# Altium project SDR_PMR.PrjPcb (part 11 of 12)

## Sheet Power_3V3.SchDoc
size A4; SheetNumber: 4; SheetTotal: 18
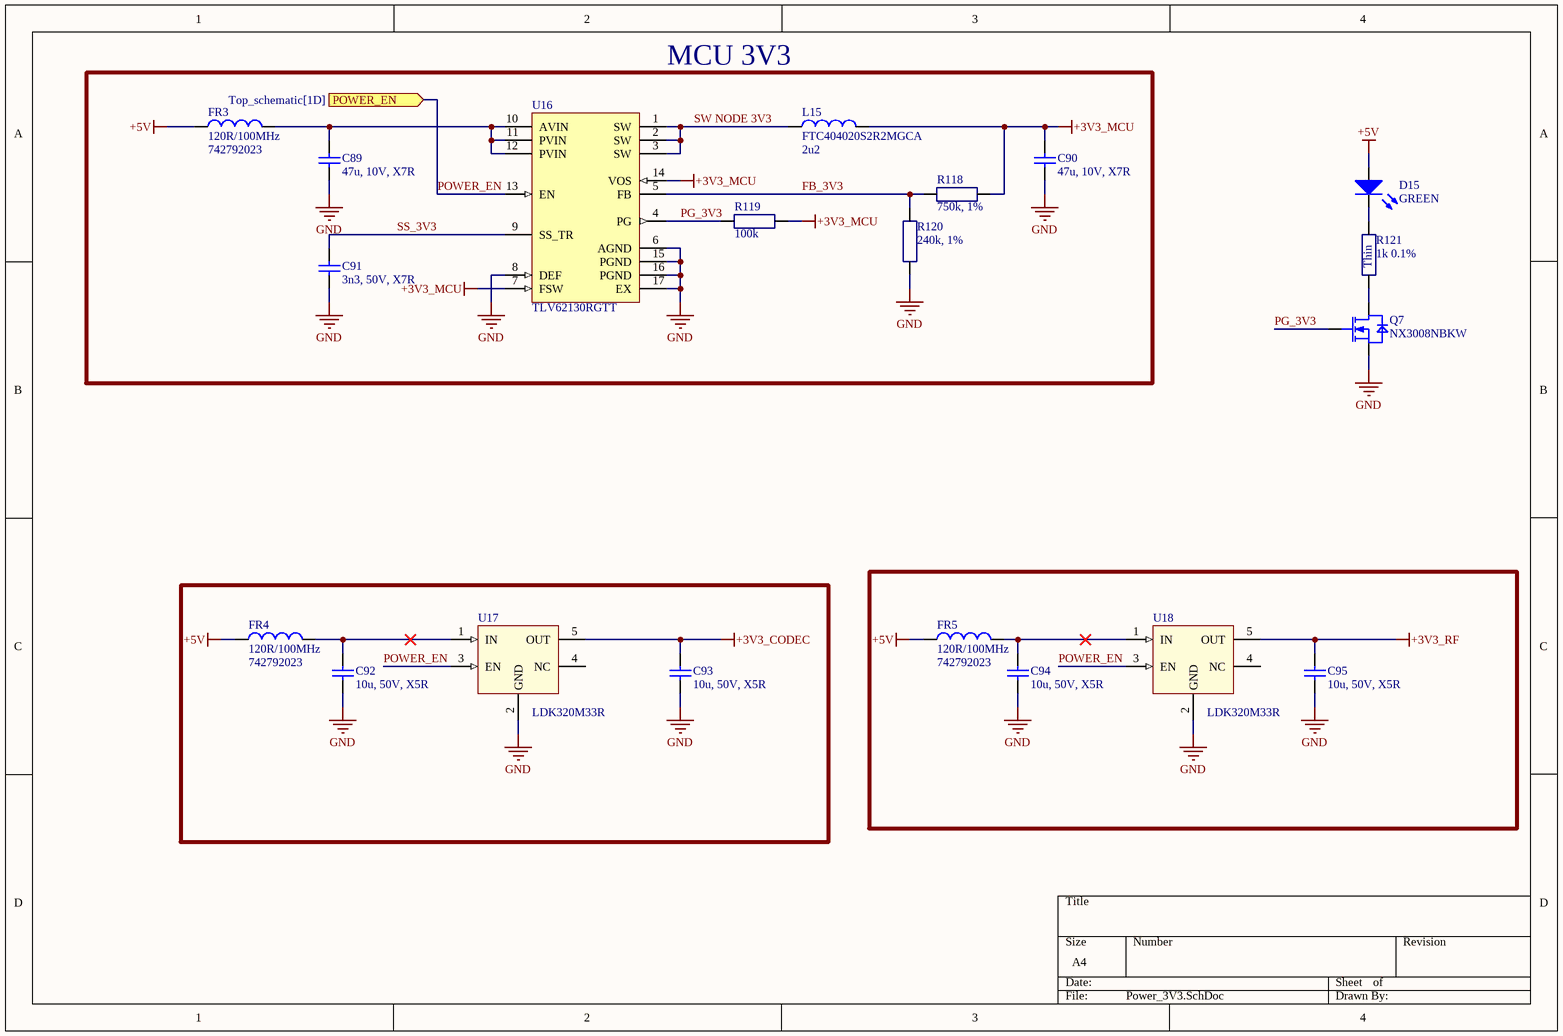
[diagram p15: Power_3V3.SchDoc]

### Parts
C89  47u, 10V, X7R  [SMD1210]
C90  47u, 10V, X7R  [SMD1210]
C91  3n3, 50V, X7R  [SMD0603]
C92  10u, 50V, X5R  [SMD1206]
C93  10u, 50V, X5R  [SMD1206]
C94  10u, 50V, X5R  [SMD1206]
C95  10u, 50V, X5R  [SMD1206]
D15  GREEN  [MCL-S270]
FR3  120R/100MHz  [SMD0805 - R]
FR4  120R/100MHz  [SMD0805 - R]
FR5  120R/100MHz  [SMD0805 - R]
L15  FTC404020S2R2MGCA  Inductance: 2u2  [FTC404020S]
Q7  NX3008NBKW  [SOT323]
R118  750k, 1%  [SMD0603 - R]
R119  100k  [SMD0402 - R]
R120  240k, 1%  [SMD0603 - R]
R121  1k 0.1%  [SMD0402 - R]
U16  TLV62130RGTT  [QFN50P300X300X80_HS-17M]
U17  LDK320M33R  [SOT23-5]
U18  LDK320M33R  [SOT23-5]

### Blocks framed on the sheet
MCU 3V3: C89-C91 FR3 L15 R118-R120 U16

### Ports
POWER_EN (in, see Top_schematic[1D])

### Nets
+3V3_CODEC: C93.2 U17.5(OUT)
+3V3_MCU: C90.2 L15.2 R118.2 R119.2 U16.7(FSW) U16.14(VOS)
+3V3_RF: C95.2 U18.5(OUT)
+5V: D15.1(A) FR3.1 FR4.1 FR5.1
GND: C89.1 C90.1 C91.1 C92.1 C93.1 C94.1 C95.1 Q7.2(S) R120.1 U16.6(AGND) U16.8(DEF) U16.15(PGND) U16.16(PGND) U16.17(EX) U17.2(GND) U18.2(GND)
FB_3V3: R118.1 R120.2 U16.5(FB)
PG_3V3: Q7.1(G) R119.1 U16.4(PG)
POWER_EN: U16.13(EN) U17.3(EN) U18.3(EN) ; port POWER_EN  [project net PG_5V]
SS_3V3: C91.2 U16.9(SS_TR)
SW NODE 3V3: L15.1 U16.1(SW) U16.2(SW) U16.3(SW)
NetC89_2: C89.2 FR3.2 U16.10(AVIN) U16.11(PVIN) U16.12(PVIN)
NetC92_2: C92.2 FR4.2 U17.1(IN)
NetC94_2: C94.2 FR5.2 U18.1(IN)
NetD15_2: D15.2(K) R121.2
NetQ7_3: Q7.3(D) R121.1

Not connected (* = marked no-connect by the designer): U17 4(NC); U18 4(NC)

### Notes on the sheet
- (in symbol TC0225B1001TCC) Thin

### Library data of the parts
C89 C90 = CL32B476MPJNNNE: Cap Ceramic 47uF 10V X7R 20% Pad SMD 1210 125C T/R; Manufacturer: Samsung; Supplier 1: Mouser; Supplier Part Number 1: 187-CL32B476MPJNNNE; Manufacturer Part Number: CL32B476MPJNNNE; RoHS: Yes; Category: Ceramic Capacitors; Stock 1: 61232; Pricing 1: 1=0.51, 10=0.377, 50=0.377, 100=0.263, 1000=0.198, 10000=0.163 (USD); Case/Package: 1210; Dielectric: X7R; Voltage Rating (DC): 10V; Tolerance: 20%; Value: 47uF; RoHS Compliant: Yes; ComponentLink1URL: http://www.samsungsem.com/kr/support/library/product-catalog/__icsFiles/afieldfile/2014/11/13/MLCC.pdf?src-supplier=Avnet; ComponentLink1Description: http://www.samsungsem.com/kr/support/library/product-catalog/__icsFiles/afieldfile/2014/11/13/MLCC.pdf?src-supplier=Avnet; Supplier 2: Arrow Electronics; Supplier Part Number 2: CL32B476MPJNNNE
C91 = 0603B332K500CT: WALSIN - 0603B332K500CT - CAPACITOR, MLCC, X7R, 3300PF, 50V, 0603; Ceramic Capacitor Case: 0603 [1608 Metric]; Voltage Rating: 50; Capacitance Tolerance: ± 10%; Dielectric Characteristic: X7; Supplier 1: Farnell; Supplier Part Number 1: 2496853; Manufacturer: WALSIN; Manufacturer Part Number: 0603B332K500CT; RoHS: YES; Stock 1: 10797; Pricing 1: 10=0,0068, 100=0,0053, 500=0,0038, 1000=0,0031, 2000=0,0027 (GBP); Capacitance: 3n3; Product Range: -; Packaging: Cut Tape; Operating Temperature Min: -55; Operating Temperature Max: 125; Automotive Qualification Standard: -; MSL: MSL 1 - Unlimited<!--FANDB--><div class="features-and-benefits-container"><div class="features-and-benefits-desc-container"><span class="features-and-benefits-container-desc">SMD Multilayer Ceramic Capacitor, 0603 [1608 Metric], 3300 pF, 50 V, ± 10%, X7R</span></div><div class="features-and-benefits-description"><span class="features-benefits-value">The general purpose series capacitors from Walsin are X7R dielectric multilayer ceramic chip capacitors (MLCC) that provides high electrical precision, stability and reliability. These MLCC capacitors consist of a conducting material and electrodes. The high density and high efficiency ceramic condensers are used to manufacture chip type miniaturized MLCC capacitors.</span></div><div class="features-and-benefits-list"><ul class="features-and-benefits-list-list"><li class="features-and-benefits-list-item">Capacitance values ranges from 100pF to 47?F</li><li class="features-and-benefits-list-item">EIA 0201, 0402, 0603, 0805, 1206, 1210, 1812 case sizes available</li><li class="features-and-benefits-list-item">Available voltage ratings are 6.3V, 10V, 16V, 25V, 35V, 50V, 100V</li><li class="features-and-benefits-list-item">Operating temperature range from -55°C to 125°C</li><li class="features-and-benefits-list-item">Available in ±5%, ±10%, ±20; ComponentLink1URL: http://www.farnell.com/datasheets/2340522.pdf; ComponentLink1Description: http://www.farnell.com/datasheets/2340522.pdf; Supplier 2: Digi-Key; Supplier Part Number 2: BC1249TR-ND
C92-C95 = UMK316BBJ106KL-T: CAP CER 10UF 50V X5R 1206; Manufacturer: Taiyo Yuden; Tolerance: 10%; Supplier 1: Mouser; Supplier Part Number 1: 963-UMK316BBJ106KL-T; Manufacturer Part Number: UMK316BBJ106KL-T; RoHS: Yes; Category: Ceramic Capacitors; Stock 1: 207945; Pricing 1: 1=0,42000, 10=0,18000, 100=0,12800, 500=0,11000, 1000=0,09700, 2000=0,08000 (USD); Mount: Surface Mount; Case/Package: 1206; Min Operating Temperature: -55°C; Max Operating Temperature: 85°C; Packaging: Tape and Reel; Capacitance: 10u; Voltage Rating: 50V; Length: 0.126inch; Width: 0.063inch; Thickness: 0.071inch; Lead Free: Lead Free; ComponentLink1URL: http://ds.yuden.co.jp/TYCOMPAS/ut/detail.do?productNo=UMK316BBJ106KL-T&fileName=UMK316BBJ106KL-T_SS&mode=specSheetDownload&src-supplier=Digi-Key; ComponentLink1Description: http://ds.yuden.co.jp/TYCOMPAS/ut/detail.do?productNo=UMK316BBJ106KL-T&fileName=UMK316BBJ106KL-T_SS&mode=specSheetDownload&src-supplier=Digi-Key; ComponentLink2URL: https://www.yuden.co.jp/productdata/catalog/mlcc01_e.pdf?src-supplier=Digi-Key; ComponentLink2Description: https://www.yuden.co.jp/productdata/catalog/mlcc01_e.pdf?src-supplier=Digi-Key; ComponentLink3URL: http://www.yuden.co.jp/productdata/catalog/en/mlcc_all_e.pdf?src-supplier=Digi-Key; ComponentLink3Description: http://www.yuden.co.jp/productdata/catalog/en/mlcc_all_e.pdf?src-supplier=Digi-Key; Supplier 2: Digi-Key; Supplier Part Number 2: 587-5960-1-ND; Supplier 3: Avnet; Supplier Part Number 3: UMK316BBJ106KL-T
D15 = MCL-S270GC: MULTICOMP - MCL-S270GC - LED, 0805, GREEN, 10MCD, 570NM; LED Mounting: SMD; Bulb Size: 1.25mm x 1.4; Forward Current If: 20; Forward Voltage: 2.1; Wavelength Typ: 570; Luminous Intensity: 10; Viewing Angle: 140°; Lens Shape: Rectangular; SVHC: No SVHC (17-Dec-2015); Forward Voltage VF Max: 2.6; LED / Lamp Size: 1.4mm x 1.25; LED Type: Standard; Luminous Intensity Max: 16; Luminous Intensity Min: 4.5; No. of Pins: 2; Peak Forward Current: 100; Peak Wavelength: 568; Reverse Protection Voltage: 5; Voltage Vf Min: 1.7; Voltage Vf Typ: 2.1V<!--FANDB--><div class="features-and-benefits-container"><div class="features-and-benefits-description"><span class="features-benefits-value">The MCL-S270GC is a green SMD LED made of GaP dice. This LED offers water clear rectangular lens and 260°C for 5 seconds lead soldering temperature range 1.6mm from body.</span></div><div class="features-and-benefits-list"><ul class="features-and-benefits-list-list"><li class="features-and-benefits-list-item">-40 to 85; Manufacturer: MULTICOMP; Manufacturer Part Number: MCL-S270GC; RoHS: YES; Stock 1: 80989; Pricing 1: 5=0,145, 25=0,136, 100=0,126, 250=0,0813, 500=0,0645, 2000=0,0559, 5000=0,0496, 20000=0,0434 (GBP); LED Colour: Green; Packaging: Cut Tape; Product Range: -; Automotive Qualification Standard: -; MSL: MSL 3 - 168 hours; Current Rating: 20; Dominant Wavelength: 570; Dominant Wavelength Typ: 570; Forward Current If Max: 20; Luminous Intensity Typ: 10; Operating Temperature Max: 85; Operating Temperature Min: -40; Operating Temperature Range: -40°C to +85; Storage Temperature Max: +100; Storage Temperature Min: -40; ComponentLink1URL: http://www.farnell.com/cad/53028.pdf; ComponentLink1Description: http://www.farnell.com/cad/53028.pdf; ComponentLink2URL: http://www.farnell.com/datasheets/1671537.pdf; ComponentLink2Description: http://www.farnell.com/datasheets/1671537.pdf; Supplier 1: Farnell; Supplier Part Number 1: 1581242; Supplier 2: Newark; Supplier Part Number 2: 14N9356
FR3-FR5 = 742792023: WURTH ELEKTRONIK - 742792023 - FERRITE BEAD, 0.03OHM, 3A, 0805; Impedance @ 100MHz: 120; Ferrite Case Style: 0805 [2012 Metric]; DC Current Rating: 3; DC Resistance Max: 0.03; Impedance Tolerance: ± 25%; Ferrite Mounting: SMD; Resistance: 0.03ohm<!--FANDB--><div class="features-and-benefits-container"><div class="features-and-benefits-description"><span class="features-benefits-value">The 742792023 is a SMD EMI Suppression Ferrite Bead with 0805 case and reliable Ni-Sn electrodes. It can be put directly on the printed circuit board. It offers excellent anti-EMI properties and low DC resistance. Placed very close next to the interference source even with smallest size 0402, maximal impedance at 1000; Manufacturer: WURTH ELEKTRONIK; RoHS: YES; Stock 1: 4283; Pricing 1: 1=0,123, 50=0,112, 100=0,103, 500=0,0937, 1000=0,0877, 2000=0,0846 (GBP); Product Range: -; Automotive Qualification Standard: -; Packaging: Cut Tape; ComponentLink1URL: http://www.farnell.com/datasheets/1695980.pdf; ComponentLink1Description: http://www.farnell.com/datasheets/1695980.pdf; ComponentLink2URL: http://www.farnell.com/cad/1670054.zip; ComponentLink2Description: http://www.farnell.com/cad/1670054.zip; Supplier 1: Mouser; Supplier Part Number 1: 710-742792023; Supplier 2: Farnell; Supplier Part Number 2: 1635732; Supplier 3: Digi-Key; Supplier Part Number 3: 732-1613-1-ND; Manufacturer Part Number: 742792023
L15 = FTC404020S2R2MGCA: FIXED IND 2.2uH 5.5A 36mΩ SMD,4.1x4.1mm; Manufacturer: Cjiang; Supplier 1: LCSC; Supplier Part Number 1: C39676070; Manufacturer Part Number: FTC404020S2R2MGCA; Category: Uncategorized; Stock 1: 6495; Pricing 1: 5=0.2588, 50=0.1952, 150=0.1679, 500=0.134, 3000=0.1188, 6000=0.1097 (USD)
Q7 = NX3008NBKW: NXP - NX3008NBKW - MOSFET, N CH, 30V, 350MA, SOT323; Transistor Polarity: N Channel; Continuous Drain Current Id: 350; Drain Source Voltage Vds: 30; On Resistance Rds(on): 1; Rds(on) Test Voltage Vgs: 4.5; Threshold Voltage Vgs: 900; Power Dissipation Pd: 260; Transistor Case Style: SOT-323; No. of Pins: 3; SVHC: No SVHC (17-Dec-2015); Pulse Current Idm: -0.8; Voltage Vgs th Max: 8; Manufacturer: NXP; Manufacturer Part Number: NX3008NBKW; RoHS: YES; Stock 1: 4764; Pricing 1: 1=0.0425, 25=0.0385, 100=0.0347, 250=0.0334, 500=0.0312, 2000=0.0291, 4000=0.0282, 20000=0.0273 (GBP); Operating Temperature Max: 150; Product Range: -; Automotive Qualification Standard: -; MSL: MSL 1 - Unlimited; Operating Temperature Min: -55; Operating Temperature Range: -55°C to +150; ComponentLink1URL: http://www.farnell.com/datasheets/1508392.pdf; ComponentLink1Description: http://www.farnell.com/datasheets/1508392.pdf; Supplier 1: Mouser; Supplier Part Number 1: 771-NX3008NBKW,115; Supplier 2: Farnell; Supplier Part Number 2: 2069546; Supplier 3: Arrow; Supplier Part Number 3: NX3008NBKW,115
R118 = RC0603FR-07750KL: RES SMD 750K OHM 1% 1/10W 0603; Manufacturer: Yageo; Power (Watts): 0.1W, 1/10W; Temperature Coefficient: ±100ppm/°C; Manufacturer Part Number: RC0603FR-07750KL; RoHS: RoHS Compliant; Category: Resistors; Stock 1: 598645; Pricing 1: 1=0.1, 10=0.015, 100=0.006, 1000=0.00268, 2500=0.00233 (USD); Packaging: Cut Tape (CT); Part Status: Active; Tolerance: ±1%; Composition: Thick Film; Features: Moisture Resistant; Operating Temperature: -55°C ~ 155°C; Package / Case: 0603 (1608 Metric); Supplier Device Package: 0603; Size / Dimension: 0.063" L x 0.032" W (1.60mm x 0.80mm); Height - Seated (Max): 0.022" (0.55mm); Failure Rate: -; ComponentLink1URL: http://www.yageo.com/documents/recent/PYu-RC_Group_51_RoHS_L_8.pdf; ComponentLink1Description: http://www.yageo.com/documents/recent/PYu-RC_Group_51_RoHS_L_8.pdf; Resistance: 750k; Supplier 1: Mouser; Supplier Part Number 1: 603-RC0603FR-07750KL; Supplier 2: Digi-Key; Supplier Part Number 2: 311-750KHRCT-ND
R119 = RC0402FR-07100KL: 62.5mW Thick Film Resistors 50V ±100ppm/℃ ±1% 100kΩ 0402 Chip Resistor - Surface Mount ROHS; Manufacturer: Yageo Group; Max Power Dissipation: 63mW; Temperature Coefficient: 100ppm/°C; Supplier: Mouser; Supplier Part Number: 603-RC0402FR-07100KL; Manufacturer Part Number: RC0402FR-07100KL; RoHS: Compliant; Category: Chip SMD Resistors; Stock: 3390880; Pricing: 1=0,1, 10=0,011, 50=0,011, 100=0,007, 1000=0,006, 10000=0,002 (USD); Case/Package: 0402; Case Code (Imperial): 0402; Case Code (Metric): 0402; China RoHS: Non-Compliant; Composition: Thick Film; Contact Plating: Tin; Depth: 500µm; Features: Moisture Resistant; Height: 350µm; Lead Free: Lead Free; Length: 1mm; Lifecycle Status: Production; Max Operating Temperature: 155°C; Military Standard: Not; Min Operating Temperature: -55°C; Mounting Technology: Surface Mount; Pins: 2; Number of Terminals: 2; Number of Terminations: 2; Packaging: Cut Tape (CT); Power Rating: 62.5mW; Radiation Hardening: No; REACH SVHC: Yes; Resistance: 100k; Schedule B: 8533210045, 8533210045|8533210045, 8533210045|8533210045|8533210045, 8533210045|8533210045|8533210045|8533210045; Termination: SMD/SMT; Tolerance: 1%; Voltage Rating: 50V; Voltage Rating (AC): 50V; Voltage Rating (DC): 50V; Width: 500µm; Working Voltage: 50V; ComponentLink1URL: https://datasheet.octopart.com:443/RC0402FR-07100KL-Yageo-datasheet-175887523.pdf?src-supplier=Newark; ComponentLink1Description: https://datasheet.octopart.com:443/RC0402FR-07100KL-Yageo-datasheet-175887523.pdf?src-supplier=Newark; ComponentLink2URL: https://datasheet.octopart.com:443/RC0402FR-07100KL-Yageo-datasheet-10408619.pdf?src-supplier=Newark; ComponentLink2Description: https://datasheet.octopart.com:443/RC0402FR-07100KL-Yageo-datasheet-10408619.pdf?src-supplier=Newark; ComponentLink3URL: https://datasheet.octopart.com:443/RC0402FR-07100KL-Yageo-datasheet-8324527.pdf?src-supplier=Newark; ComponentLink3Description: https://datasheet.octopart.com:443/RC0402FR-07100KL-Yageo-datasheet-8324527.pdf?src-supplier=Newark; ComponentLink4URL: https://datasheet.octopart.com:443/RC0402FR-07100KL-Yageo-datasheet-103092701.pdf?src-supplier=Upverter; ComponentLink4Description: https://datasheet.octopart.com:443/RC0402FR-07100KL-Yageo-datasheet-103092701.pdf?src-supplier=Upverter; ComponentLink5URL: https://datasheet.octopart.com:443/RC0402FR-07100KL-Yageo-datasheet-141435361.pdf?src-supplier=Upverter; ComponentLink5Description: https://datasheet.octopart.com:443/RC0402FR-07100KL-Yageo-datasheet-141435361.pdf?src-supplier=Upverter; ComponentLink6URL: https://datasheet.octopart.com:443/RC0402FR-07100KL-Yageo-datasheet-62067350.pdf?src-supplier=Farnell; ComponentLink6Description: https://datasheet.octopart.com:443/RC0402FR-07100KL-Yageo-datasheet-62067350.pdf?src-supplier=Farnell; ComponentLink7URL: https://datasheet.octopart.com:443/RC0402FR-07100KL-Yageo-datasheet-12531192.pdf?src-supplier=Future+Electronics; ComponentLink7Description: https://datasheet.octopart.com:443/RC0402FR-07100KL-Yageo-datasheet-12531192.pdf?src-supplier=Future+Electronics; ComponentLink8URL: https://datasheet.octopart.com:443/RC0402FR-07100KL-Yageo-Group-datasheet-176638170.pdf?src-supplier=Future+Electronics; ComponentLink8Description: https://datasheet.octopart.com:443/RC0402FR-07100KL-Yageo-Group-datasheet-176638170.pdf?src-supplier=Future+Electronics; ComponentLink9URL: https://datasheet.octopart.com:443/RC0402FR-07100KL-Yageo-datasheet-164759695.pdf?src-supplier=Future+Electronics; ComponentLink9Description: https://datasheet.octopart.com:443/RC0402FR-07100KL-Yageo-datasheet-164759695.pdf?src-supplier=Future+Electronics; ComponentLink10URL: https://datasheet.octopart.com:443/RC0402FR-07100KL-Yageo-datasheet-127823281.pdf?src-supplier=Future+Electronics; ComponentLink10Description: https://datasheet.octopart.com:443/RC0402FR-07100KL-Yageo-datasheet-127823281.pdf?src-supplier=Future+Electronics; ComponentLink11URL: https://datasheet.octopart.com:443/RC0402FR-07100KL-Yageo-datasheet-137700087.pdf?src-supplier=Future+Electronics; ComponentLink11Description: https://datasheet.octopart.com:443/RC0402FR-07100KL-Yageo-datasheet-137700087.pdf?src-supplier=Future+Electronics; ComponentLink12URL: https://datasheet.octopart.com:443/RC0402FR-07100KL-Yageo-datasheet-98239111.pdf?src-supplier=Future+Electronics; ComponentLink12Description: https://datasheet.octopart.com:443/RC0402FR-07100KL-Yageo-datasheet-98239111.pdf?src-supplier=Future+Electronics; ComponentLink13URL: https://datasheet.octopart.com:443/RC0402FR-07100KL-Yageo-datasheet-77992522.pdf?src-supplier=Future+Electronics; ComponentLink13Description: https://datasheet.octopart.com:443/RC0402FR-07100KL-Yageo-datasheet-77992522.pdf?src-supplier=Future+Electronics; ComponentLink14URL: https://datasheet.octopart.com:443/RC0402FR-07100KL-Yageo-datasheet-67302840.pdf?src-supplier=Future+Electronics; ComponentLink14Description: https://datasheet.octopart.com:443/RC0402FR-07100KL-Yageo-datasheet-67302840.pdf?src-supplier=Future+Electronics; ComponentLink15URL: https://datasheet.octopart.com:443/RC0402FR-07100KL-Yageo-datasheet-8324255.pdf?src-supplier=Future+Electronics; ComponentLink15Description: https://datasheet.octopart.com:443/RC0402FR-07100KL-Yageo-datasheet-8324255.pdf?src-supplier=Future+Electronics; ComponentLink16URL: https://datasheet.octopart.com:443/RC0402FR-07100KL-Yageo-datasheet-8329306.pdf?src-supplier=element14; ComponentLink16Description: https://datasheet.octopart.com:443/RC0402FR-07100KL-Yageo-datasheet-8329306.pdf?src-supplier=element14; ComponentLink17URL: https://datasheet.octopart.com:443/RC0402FR-07100KL-Yageo-datasheet-175423674.pdf?src-supplier=SOS+electronic; ComponentLink17Description: https://datasheet.octopart.com:443/RC0402FR-07100KL-Yageo-datasheet-175423674.pdf?src-supplier=SOS+electronic; ComponentLink18URL: https://datasheet.octopart.com:443/RC0402FR-07100KL-Yageo-datasheet-148775077.pdf?src-supplier=TME; ComponentLink18Description: https://datasheet.octopart.com:443/RC0402FR-07100KL-Yageo-datasheet-148775077.pdf?src-supplier=TME; ComponentLink19URL: https://datasheet.octopart.com:443/RC0402FR-07100KL-Yageo-datasheet-79472498.pdf?src-supplier=Megastar; ComponentLink19Description: https://datasheet.octopart.com:443/RC0402FR-07100KL-Yageo-datasheet-79472498.pdf?src-supplier=Megastar; ComponentLink20URL: https://datasheet.octopart.com/RC0402FR-07100KL-Yageo-datasheet-73766026.pdf; ComponentLink20Description: https://datasheet.octopart.com/RC0402FR-07100KL-Yageo-datasheet-73766026.pdf; ComponentLink21URL: http://sigma.octopart.com:80/conflict_mineral_statement/Yageo-company-3.pdf?src-supplier=Compliance+Statements; ComponentLink21Description: http://sigma.octopart.com:80/conflict_mineral_statement/Yageo-company-3.pdf?src-supplier=Compliance+Statements; ComponentLink22URL: http://sigma.octopart.com:80/rohs_statement/Yageo-company-2.pdf?src-supplier=Compliance+Statements; ComponentLink22Description: http://sigma.octopart.com:80/rohs_statement/Yageo-company-2.pdf?src-supplier=Compliance+Statements
R120 = CRCW0603240KFKEA: RES SMD 240K OHM 1% 1/10W 0603; Manufacturer: Vishay; Power Rating: 100mW; Temperature Coefficient: 100ppm/°C; Voltage Rating: 75V; Manufacturer Part Number: CRCW0603240KFKEA; Stock: 14874; Pricing 1: 1=0.1, 10=0.042, 50=0.042, 100=0.017, 1000=0.008, 10000=0.005 (USD); Case/Package: 0603; Weight: 7.1E-05oz; Contact Plating: Tin; Case Code (Metric): 1608; Case Code (Imperial): 0603; Min Operating Temperature: -55°C; Max Operating Temperature: 155°C; Resistance: 240k; Tolerance: 1%; Composition: Thick Film; Packaging: Tape and Reel; Package Quantity: 10; Number of Terminations: 2; Termination: SMD/SMT; Military Standard: Not; Max Power Dissipation: 100mW; Voltage Rating (DC): 75V; Length: 1.55mm; Height: 0.45mm; Width: 0.033inch; Depth: 0.85mm; Radiation Hardening: No; Lead Free: Lead Free; REACH SVHC: Unknown; ComponentLink1URL: https://datasheet.ciiva.com/11811/0900766b80d98afc-11811310.pdf; ComponentLink1Description: https://datasheet.ciiva.com/11811/0900766b80d98afc-11811310.pdf; ComponentLink2URL: https://datasheet.ciiva.com/2525/dcrcwe3-2525362.pdf; ComponentLink2Description: https://datasheet.ciiva.com/2525/dcrcwe3-2525362.pdf; ComponentLink3URL: https://datasheet.ciiva.com/2525/dcrcwe3-2525363.pdf; ComponentLink3Description: https://datasheet.ciiva.com/2525/dcrcwe3-2525363.pdf; ComponentLink4URL: https://datasheet.ciiva.com/2525/dcrcwe3-2525364.pdf; ComponentLink4Description: https://datasheet.ciiva.com/2525/dcrcwe3-2525364.pdf; ComponentLink5URL: https://datasheet.ciiva.com/7674/1697337-7674053.pdf; ComponentLink5Description: https://datasheet.ciiva.com/7674/1697337-7674053.pdf; ComponentLink6URL: https://datasheet.ciiva.com/7674/1697337-7674213.pdf; ComponentLink6Description: https://datasheet.ciiva.com/7674/1697337-7674213.pdf; ComponentLink7URL: https://datasheet.ciiva.com/26317/fld-crcw-e3-data-en-26317174.pdf; ComponentLink7Description: https://datasheet.ciiva.com/26317/fld-crcw-e3-data-en-26317174.pdf; ComponentLink8URL: https://datasheet.ciiva.com/16394/dcrcwhr-16394568.pdf; ComponentLink8Description: https://datasheet.ciiva.com/16394/dcrcwhr-16394568.pdf; ComponentLink9URL: https://datasheet.ciiva.com/16882/dcrcwe3-16882632.pdf; ComponentLink9Description: https://datasheet.ciiva.com/16882/dcrcwe3-16882632.pdf; ComponentLink10URL: https://datasheet.ciiva.com/8955/dcrcwe3-8955548.pdf; ComponentLink10Description: https://datasheet.ciiva.com/8955/dcrcwe3-8955548.pdf; ComponentLink11URL: https://datasheet.ciiva.com/5550/dcrcwe3-109170-5550031.pdf; ComponentLink11Description: https://datasheet.ciiva.com/5550/dcrcwe3-109170-5550031.pdf; Supplier 1: Mouser; Supplier Part Number 1: 71-CRCW0603-240K-E3; Supplier 2: Farnell; Supplier Part Number 2: 1469786; Supplier 3: Digi-Key; Supplier Part Number 3: 541-240KHDKR-ND; Supplier 4: Arrow Europe; Supplier Part Number 4: CRCW0603240KFKEA
R121 = TC0225B1001TCC: 62.5mW Thin Film Resistor 25V ±25ppm/℃ ±0.1% 1kΩ 0402 Chip Resistor - Surface Mount ROHS; Manufacturer: Uniroyal; Working Voltage: 50V; Supplier 1: LCSC; Supplier Part Number 1: C2989674; Manufacturer Part Number: TC0225B1001TCC; Category: Chip SMD Resistors; Stock 1: 12060; Pricing 1: 20=0.036, 200=0.031, 600=0.0283, 2000=0.0267, 10000=0.0252, 20000=0.0245 (USD); Case/Package: 0402; Composition: Thin Film; Export Control Classification Number (ECCN) Code: EAR99; Height: 300µm; Harmonized Tariff Schedule (HTS) Code: 8533.21.00.30; Length: 1mm; Lifecycle Status: Production; Max Operating Temperature: 155°C; Min Operating Temperature: -55°C; Mounting Technology: Surface Mount; Number of Terminals: 2; Power Rating: 62.5mW; Resistance: 1k; Tolerance: 0.1%; Width: 500µm; ComponentLink1URL: https://datasheet.octopart.com:443/TC0225B1001TCC-Uniroyal-datasheet-194228365.pdf?src-supplier=LCSC; ComponentLink1Description: https://datasheet.octopart.com:443/TC0225B1001TCC-Uniroyal-datasheet-194228365.pdf?src-supplier=LCSC
U16 = TLV62130RGTT: TEXAS INSTRUMENTS - TLV62130RGTT - DC-DC CONV, BUCK, 2.5MHZ, QFN-16; Manufacturer: TEXAS INSTRUMENTS; Manufacturer Part Number: TLV62130RGTT; RoHS: YES; Stock 1: 255; Pricing 1: 1=2.12, 10=1.66, 25=1.52, 50=1.43, 100=1.34, 250=1.24, 500=1.06, 1000=0.897 (GBP); ComponentLink1URL: http://www.farnell.com/datasheets/2020451.pdf; ComponentLink1Description: http://www.farnell.com/datasheets/2020451.pdf; ComponentLink2URL: http://www.farnell.com/datasheets/1935981.pdf; ComponentLink2Description: http://www.farnell.com/datasheets/1935981.pdf; Supplier 1: Mouser; Supplier Part Number 1: 595-TLV62130RGTT; Supplier 2: Farnell; Supplier Part Number 2: 2382915; Supplier 3: Digi-Key; Supplier Part Number 3: 296-35978-1-ND
U17 U18 = LDK320M33R: IC REG LINEAR 200MA SOT23-5; Manufacturer: STMicroelectronics; Output Configuration: Positive; Output Type: Fixed; Voltage - Input (Max): 18V; Voltage - Output (Min/Fixed): 3.3V; Voltage Dropout (Max): 0.35V @ 200mA; PSRR: 88dB (120Hz); Control Features: Enable; Protection Features: Over Current, Over Temperature; Manufacturer Part Number: LDK320M33R; RoHS: RoHS Compliant; Category: Integrated Circuits (ICs); Stock 1: 5592; Pricing 1: 1=0.85, 10=0.748, 100=0.5733, 500=0.4532, 1000=0.36256 (USD); Packaging: Cut Tape (CT); Part Status: Active; Current - Output: 200mA; Operating Temperature: -40°C ~ 125°C (TJ); Mounting Type: Surface Mount; Package / Case: SC-74A, SOT-753; Supplier Device Package: SOT-23-5; ComponentLink1URL: http://www.st.com/content/ccc/resource/technical/document/datasheet/0e/0c/26/c9/a4/d4/4b/a1/DM00236470.pdf/files/DM00236470.pdf/jcr:content/translations/en.DM00236470.pdf; ComponentLink1Description: http://www.st.com/content/ccc/resource/technical/document/datasheet/0e/0c/26/c9/a4/d4/4b/a1/DM00236470.pdf/files/DM00236470.pdf/jcr:content/translations/en.DM00236470.pdf; Supplier 1: Mouser; Supplier Part Number 1: 511-LDK320M33R; Supplier 2: Farnell; Supplier Part Number 2: 3130011; Supplier 3: Digi-Key; Supplier Part Number 3: 497-17034-1-ND

## Sheet CB_CONNECTOR.SchDoc
size A4; SheetNumber: 17; SheetTotal: 18
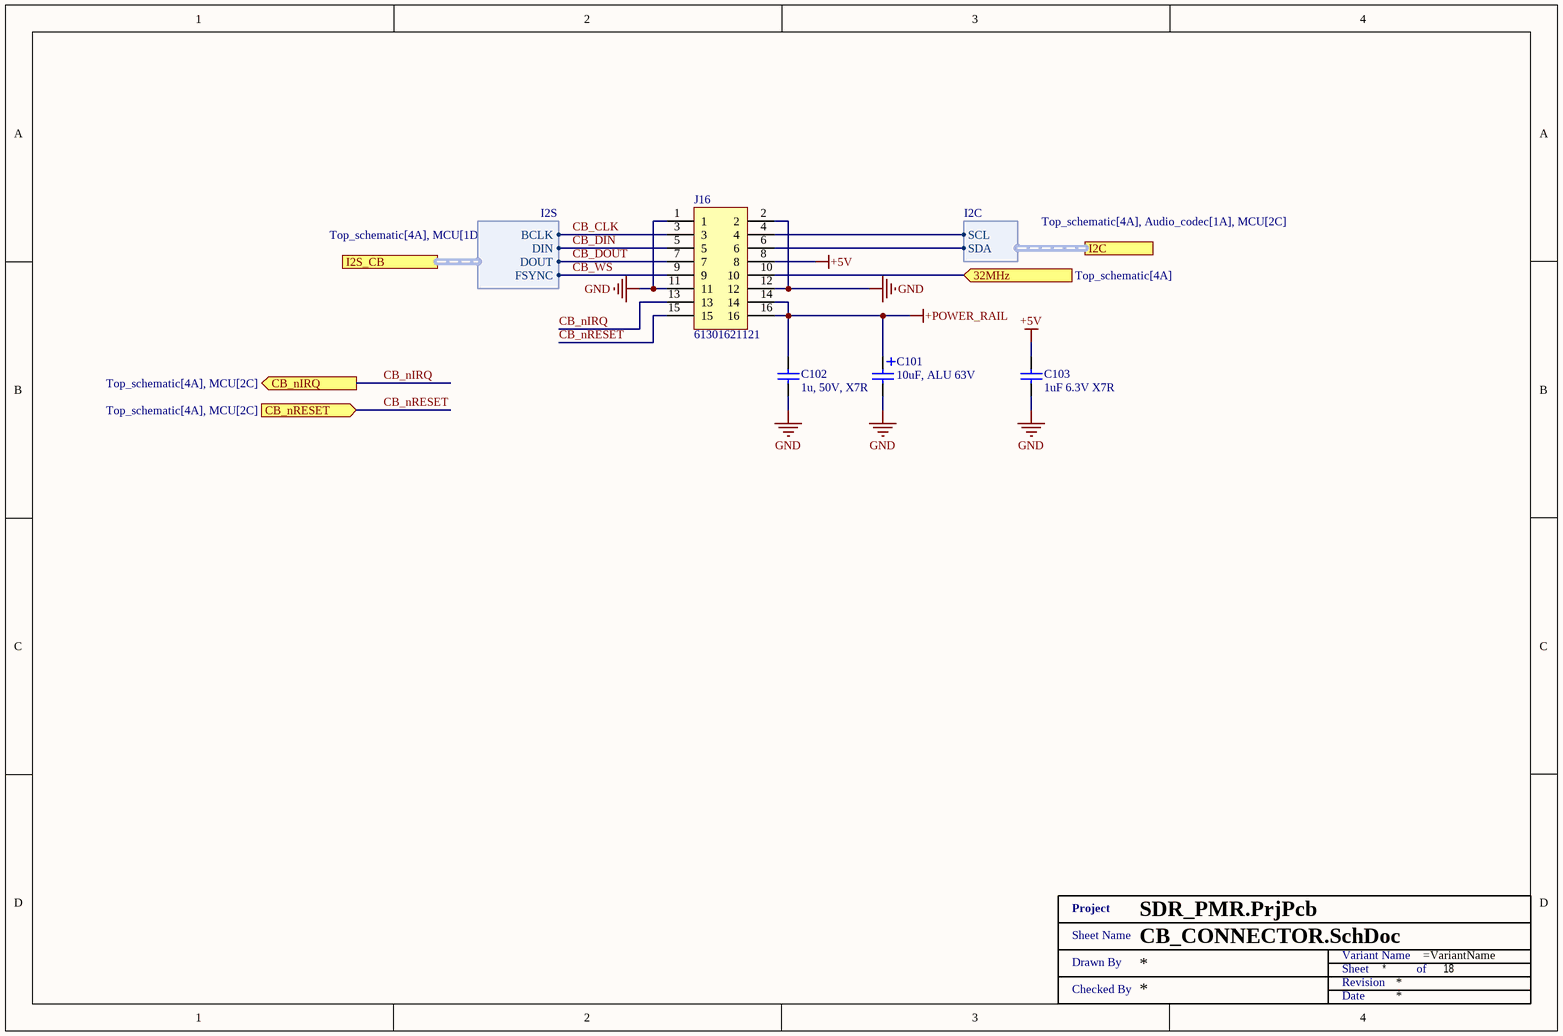
[diagram p16: CB_CONNECTOR.SchDoc]

### Parts
(Parts that share a designator on the sheet are numbered #1, #2 ... from top to bottom, then left to right.)
C101  10uF, ALU 63V  [WCAP-ATLI_5x11x2]
C102  1u, 50V, X7R  [SMD0603]
C103  1uF 6.3V X7R  [SMD0402]
J16  61301621121  [61301621121]
XX?#16  Title 1  (value not drawn)  (graphical)

### Ports
32MHz (in, see Top_schematic[4A]), CB_nIRQ (out, see Top_schematic[4A], MCU[2C]), CB_nRESET (in, see Top_schematic[4A], MCU[2C]), I2C (harness I2C, see Top_schematic[4A], Audio_codec[1A], MCU[2C]), I2S_CB (harness I2S, see Top_schematic[4A], MCU[1D])

### Harnesses
I2S: BCLK, DIN, DOUT, FSYNC
I2C: SCL, SDA

### Nets
+5V: C103.2 J16.8
+POWER_RAIL: C101.1 C102.2 J16.14 J16.16
GND: C101.2 C102.1 C103.1 J16.1 J16.2 J16.11 J16.12
CB_CLK: J16.3 ; port I2S_CB.BCLK
CB_DIN: J16.5 ; port I2S_CB.DIN
CB_DOUT: J16.7 ; port I2S_CB.DOUT
CB_nIRQ: J16.13 ; port CB_nIRQ
CB_nRESET: J16.15 ; port CB_nRESET
CB_WS: J16.9 ; port I2S_CB.FSYNC
I2C_SCL: J16.4 ; port I2C.SCL
I2C_SDA: J16.6 ; port I2C.SDA
NetJ16_10: J16.10 ; port 32MHz

### Notes on the sheet
- (in symbol Title 1) Project; Sheet Name; Variant Name; Drawn By; Sheet; of; Revision; Checked By; Date

### Library data of the parts
C101 = 860080772001: WURTH ELEKTRONIK - 860080772001 - CAP, ALU ELEC, 10UF, 63V, RADIAL; Ripple Current: 135mA @ 100kHz; Capacitance: 10u; Manufacturer: WURTH ELEKTRONIK; Manufacturer Part Number: 860080772001; RoHS: YES; Stock 1: 553; Pricing 1: 1=0.0957, 3=0.091, 5=0.0863, 10=0.0825, 20=0.0786, 50=0.0692, 250=0.0647, 500=0.0564 (GBP); ComponentLink1URL: http://www.farnell.com/datasheets/1879798.pdf; ComponentLink1Description: http://www.farnell.com/datasheets/1879798.pdf; Voltage Rating: 63V; Stock 3: 2136; Pricing 3: 1=0.62, 50=0.335, 100=0.289, 250=0.259, 500=0.235, 1500=0.202, 7500=0.182, 15000=0.178 (GBP); ComponentLink2URL: http://www.farnell.com/datasheets/2065186.pdf; ComponentLink2Description: http://www.farnell.com/datasheets/2065186.pdf; Supplier 1: Mouser; Supplier Part Number 1: 710-860080772001; Supplier 2: Farnell; Supplier Part Number 2: 2465955; Supplier 3: Digi-Key; Supplier Part Number 3: 732-9121-1-ND
C102 = UMK107AB7105KA-T: 0603 1 uF 50 V ±10% Tolerance X7R SMT Multilayer Ceramic Capacitor; Manufacturer: Taiyo Yuden; Supplier 1: Mouser; Supplier Part Number 1: 963-UMK107AB7105KA-T; Manufacturer Part Number: UMK107AB7105KA-T; RoHS: Yes; Category: Ceramic Capacitors; Stock 1: 419967; Pricing 1: 1=0,39000, 10=0,13500, 100=0,09200, 500=0,07800, 1000=0,06100, 4000=0,06100 (USD); Mount: Surface Mount; Case/Package: 0603; Case Code (Metric): 1608; Case Code (Imperial): 0603; Min Operating Temperature: -55°C; Max Operating Temperature: 125°C; Tolerance: 10%; Capacitance: 1u; Packaging: Tape and Reel; Package Quantity: 1; Voltage Rating: 50V; Voltage Rating (DC): 50V; Dielectric: X7R; Termination: SMD/SMT; Length: 1.6mm; Height: 0.8mm; Width: 0.031inch; Thickness: 0.037inch; Depth: 0.8mm; Radiation Hardening: No; Halogen Free: Halogen Free; ComponentLink1URL: https://datasheet.ciiva.com/15922/umk107ab7105ka-t-pdf-15922601.pdf?src-supplier=Onlinecomponents.com; ComponentLink1Description: https://datasheet.ciiva.com/15922/umk107ab7105ka-t-pdf-15922601.pdf?src-supplier=Onlinecomponents.com; ComponentLink2URL: https://datasheet.ciiva.com/6257/umk107ab7105ka-t-ss-6257600.pdf?src-supplier=Digi-Key; ComponentLink2Description: https://datasheet.ciiva.com/6257/umk107ab7105ka-t-ss-6257600.pdf?src-supplier=Digi-Key; ComponentLink3URL: https://datasheet.ciiva.com/30137/76umk107ab7105ka-t-30137806.pdf?src-supplier=Onlinecomponents.com; ComponentLink3Description: https://datasheet.ciiva.com/30137/76umk107ab7105ka-t-30137806.pdf?src-supplier=Onlinecomponents.com; Supplier 2: Farnell; Supplier Part Number 2: 2779113; Supplier 3: Digi-Key; Supplier Part Number 3: 587-3247-6-ND
C103 = TCC0402X7R105K6R3AT: Capacitor: MLCC; SMD; 0402; 1µF; 6.3V; ±10%; X7R; CCTC; Capacitance: 1u; Supplier 1: LCSC; Supplier Part Number 1: C5448871; Manufacturer: CCTC; Manufacturer Part Number: TCC0402X7R105K6R3AT; Category: Ceramic Capacitors; Stock 1: 242350; Pricing 1: 50=0.0089, 500=0.0072, 1500=0.0063, 10000=0.0058, 20000=0.0053, 50000=0.005 (USD); ComponentLink1URL: https://datasheet.octopart.com:443/TCC0402X7R105K6R3AT-CCTC-datasheet-194166649.pdf?src-supplier=LCSC; ComponentLink1Description: https://datasheet.octopart.com:443/TCC0402X7R105K6R3AT-CCTC-datasheet-194166649.pdf?src-supplier=LCSC; ComponentLink2URL: https://datasheet.octopart.com:443/TCC0402X7R105K6R3AT-CCTC-datasheet-192317456.pdf?src-supplier=HQonline; ComponentLink2Description: https://datasheet.octopart.com:443/TCC0402X7R105K6R3AT-CCTC-datasheet-192317456.pdf?src-supplier=HQonline
J16 = 61301621121: WR-PHD 2.54 mm THT Dual Pin Header, 16 pins; Manufacturer: Wurth Electronics; Number of Positions: 16; Gender: Male; Connector Type: Male Pin; Pitch: 0.1inch; Supplier 1: Mouser; Supplier Part Number 1: 710-61301621121; Manufacturer Part Number: 61301621121; RoHS: Yes; Category: Headers and Wire Housings; Stock 1: 8961; Pricing 1: 1=1,02000, 10=0,89100, 50=0,61900, 100=0,56200, 1000=0,51200, 10000=0,51100 (USD); Mount: Through Hole; Contact Plating: Gold; Contact Material: Copper; Color: Black; Number of Rows: 2; Packaging: Bulk; Termination: Solder; Number of Contacts: 16; Series: WR-PHD; Contact Type: Male Pin; Row Spacing: 0.1inch; Contact Mating Length: 0.236inch; RoHS Compliant: Yes; ComponentLink1URL: https://datasheet.ciiva.com/28505/1442180-28505592.pdf?src-supplier=Element14; ComponentLink1Description: https://datasheet.ciiva.com/28505/1442180-28505592.pdf?src-supplier=Element14; Supplier 2: Farnell; Supplier Part Number 2: 2356136; Supplier 3: Digi-Key; Supplier Part Number 3: 732-5299-ND

## Sheet 32MHz_clock.SchDoc
size A4; SheetNumber: 18; SheetTotal: 18
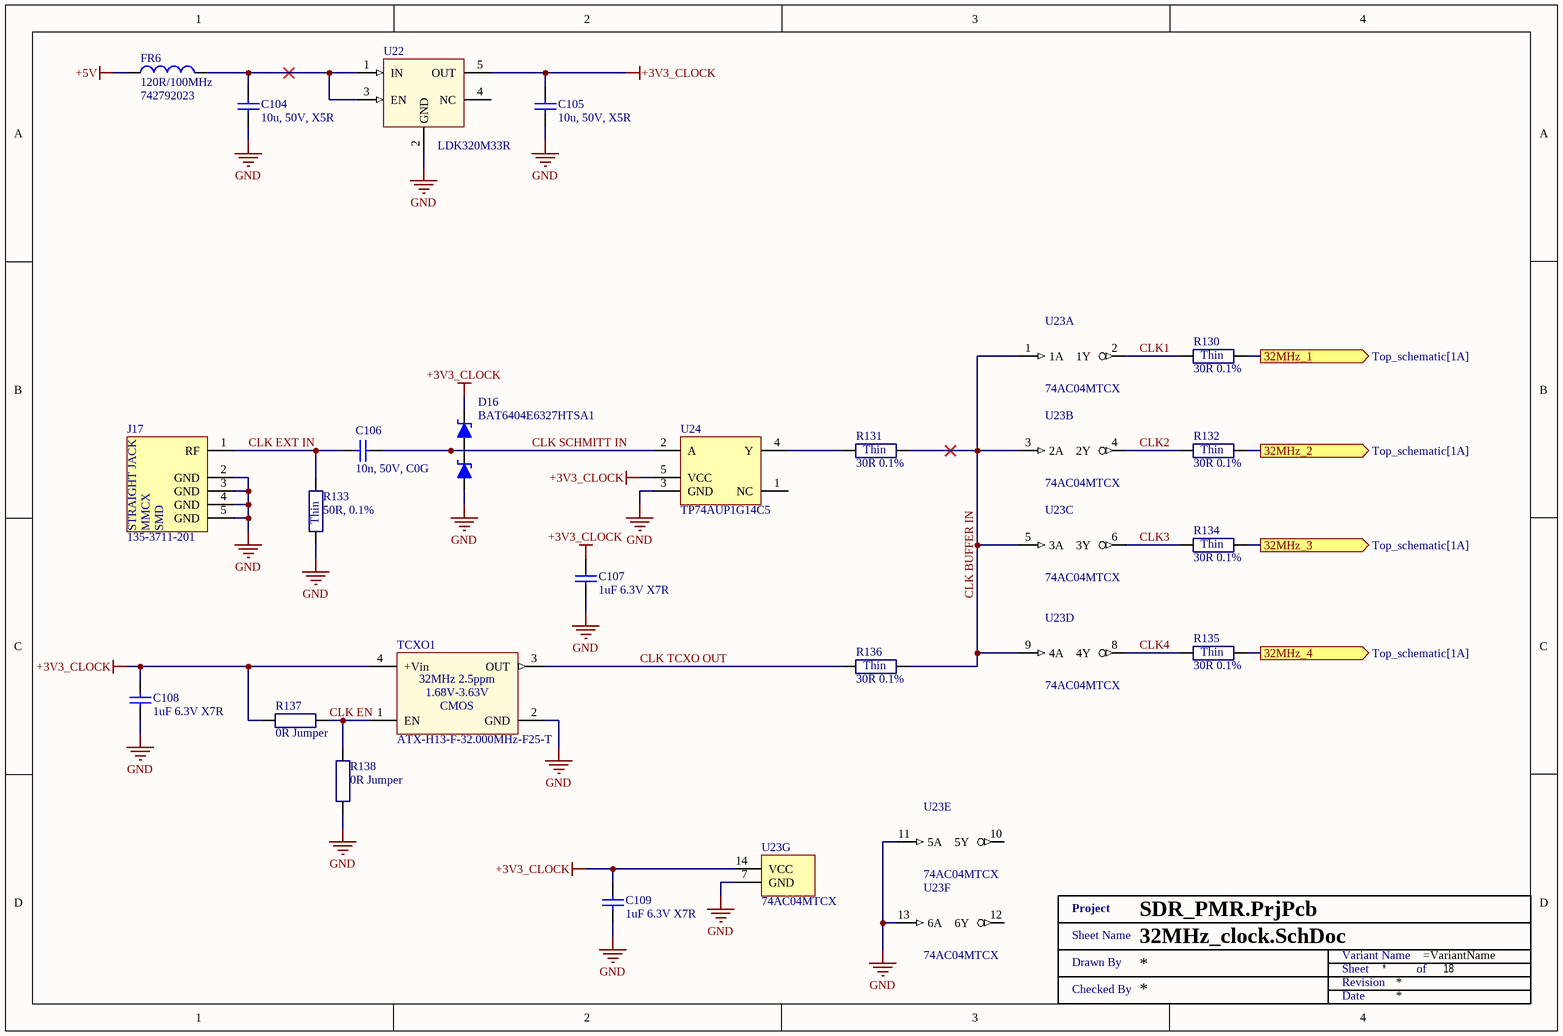
[diagram p17: 32MHz_clock.SchDoc]

### Parts
(Parts that share a designator on the sheet are numbered #1, #2 ... from top to bottom, then left to right.)
C104  10u, 50V, X5R  [SMD1206]
C105  10u, 50V, X5R  [SMD1206]
C106  10n, 50V, C0G  [SMD0603]
C107  1uF 6.3V X7R  [SMD0402]
C108  1uF 6.3V X7R  [SMD0402]
C109  1uF 6.3V X7R  [SMD0402]
D16  BAT6404E6327HTSA1  [SOT23 (TO-236AB)]
FR6  120R/100MHz  [SMD0805 - R]
J17  135-3711-201  [135-3711-201]
R130  30R 0.1%  [SMD0402 - R]
R131  30R 0.1%  [SMD0402 - R]
R132  30R 0.1%  [SMD0402 - R]
R133  50R, 0.1%  [SMD0603 - R]
R134  30R 0.1%  [SMD0402 - R]
R135  30R 0.1%  [SMD0402 - R]
R136  30R 0.1%  [SMD0402 - R]
R137  0R Jumper  [SMD0402 - R]
R138  0R Jumper  [SMD0402 - R]
TCXO1  ATX-H13-F-32.000MHz-F25-T  [2.0x1.6mm]
U22  LDK320M33R  [SOT23-5]
U23  74AC04MTCX  [TSSOP14]  (parts A,B,C,D,E,F,G of 7)
U24  TP74AUP1G14C5  [SOT353]
XX?#17  Title 1  (value not drawn)  (graphical)

### Ports
32MHz_1 (out, see Top_schematic[1A]), 32MHz_2 (out, see Top_schematic[1A]), 32MHz_3 (out, see Top_schematic[1A]), 32MHz_4 (out, see Top_schematic[1A])

### Nets
+3V3_CLOCK: C105.2 C107.2 C108.2 C109.2 D16.2(C) R137.1 TCXO1.4(+Vin) U22.5(OUT) U23.14(VCC) U24.5(VCC)
+5V: FR6.1
GND: C104.1 C105.1 C107.1 C108.1 C109.1 D16.1(A) J17.2(GND) J17.3(GND) J17.4(GND) J17.5(GND) R133.1 R138.1 TCXO1.2(GND) U22.2(GND) U23.7(GND) U23.11(5A) U23.13(6A) U24.3(GND)
CLK1: R130.1 U23.2(1Y)
CLK2: R132.1 U23.4(2Y)
CLK3: R134.1 U23.6(3Y)
CLK4: R135.1 U23.8(4Y)
CLK BUFFER IN: R131.2 R136.2 U23.1(1A) U23.3(2A) U23.5(3A) U23.9(4A)
CLK EN: R137.2 R138.2 TCXO1.1(EN)
CLK EXT IN: C106.2 J17.1(RF) R133.2
CLK SCHMITT IN: C106.1 D16.3(C) U24.2(A)
CLK TCXO OUT: R136.1 TCXO1.3(OUT)
NetC104_2: C104.2 FR6.2 U22.1(IN) U22.3(EN)
NetJ16_10: R130.2 ; port 32MHz_1
NetR50_1: R135.2 ; port 32MHz_4
NetR131_1: R131.1 U24.4(Y)
NetR132_2: R132.2 ; port 32MHz_2
NetR134_2: R134.2 ; port 32MHz_3

Not connected (* = marked no-connect by the designer): U22 4(NC); U23 10(5Y) 12(6Y); U24 1(NC)

### Notes on the sheet
- (in symbol 135-3711-201) STRAIGHT JACK; MMCX; SMD
- (in symbol ATX-H13-F-32.000MHZ-F25-T) 32MHz 2.5ppm; 1.68V-3.63V
- (in symbol RT0603BRE0750RL) Thin
- (in symbol TC0225B300JTCC) Thin
- (in symbol Title 1) Project; Sheet Name; Variant Name; Drawn By; Sheet; of; Revision; Checked By; Date

### Library data of the parts
C104 C105 = UMK316BBJ106KL-T: as C92-C95 on sheet Power_3V3; Supplier 1: Mouser; Supplier Part Number 1: 963-UMK316BBJ106KL-T; Manufacturer Part Number: UMK316BBJ106KL-T; RoHS: Yes; Category: Ceramic Capacitors; Stock 1: 207945; Pricing 1: 1=0,42000, 10=0,18000, 100=0,12800, 500=0,11000, 1000=0,09700, 2000=0,08000 (USD); Mount: Surface Mount; Case/Package: 1206; Min Operating Temperature: -55°C; Max Operating Temperature: 85°C; Packaging: Tape and Reel; Capacitance: 10u; Voltage Rating: 50V; Length: 0.126inch; Width: 0.063inch; Thickness: 0.071inch; Lead Free: Lead Free; ComponentLink1URL: http://ds.yuden.co.jp/TYCOMPAS/ut/detail.do?productNo=UMK316BBJ106KL-T&fileName=UMK316BBJ106KL-T_SS&mode=specSheetDownload&src-supplier=Digi-Key; ComponentLink1Description: http://ds.yuden.co.jp/TYCOMPAS/ut/detail.do?productNo=UMK316BBJ106KL-T&fileName=UMK316BBJ106KL-T_SS&mode=specSheetDownload&src-supplier=Digi-Key; ComponentLink2URL: https://www.yuden.co.jp/productdata/catalog/mlcc01_e.pdf?src-supplier=Digi-Key; ComponentLink2Description: https://www.yuden.co.jp/productdata/catalog/mlcc01_e.pdf?src-supplier=Digi-Key; ComponentLink3URL: http://www.yuden.co.jp/productdata/catalog/en/mlcc_all_e.pdf?src-supplier=Digi-Key; ComponentLink3Description: http://www.yuden.co.jp/productdata/catalog/en/mlcc_all_e.pdf?src-supplier=Digi-Key; Supplier 2: Digi-Key; Supplier Part Number 2: 587-5960-1-ND; Supplier 3: Avnet; Supplier Part Number 3: UMK316BBJ106KL-T
C106 = GRM1885C1H103JA01D: Multilayer Ceramic Capacitors MLCC - SMD/SMT 0603 50VDC 10000pF 5% C0G; Manufacturer: Murata Electronics; Type: Chip Multilayer Ceramic Capacitor for General Purpose; Capacitance - nF: 10 nF; Class: Class 1; CNHTS: 8532241000; Dielectric: C0G (NP0); TARIC: 8532240000; Supplier 1: Mouser; Supplier Part Number 1: 81-GRM1885C1H103JA1D; Manufacturer Part Number: GRM1885C1H103JA01D; RoHS: RoHS Compliant; Category: Multilayer Ceramic Capacitors MLCC - SMD/SMT; Stock 1: 217291; Pricing 1: 1=0.183, 10=0.129, 100=0.065, 500=0.045, 1000=0.039, 4000=0.030, 8000=0.027, 24000=0.025 (EUR); Capacitance: 10n; Height: 0.8 mm; Length: 1.6 mm; Package / Case: 0603 (1608 metric); Packaging: Cut Tape; Product: General Type MLCCs; Series: GRM; Termination Style: SMD/SMT; Tolerance: 5 %; Voltage Rating DC: 50 VDC; Width: 0.8 mm; Brand: Murata Electronics; Capacitance - pF: 10000 pF; Case Code - in: 0603; Case Code - mm: 1608; HTS Code: 8532240020; Maximum Operating Temperature: + 125 C; Minimum Operating Temperature: - 55 C; Product Type: Ceramic Capacitors; Standard Pack Qty: 4000; Subcategory: Capacitors; Termination: Standard; RoHS - Mouser: Y; Minimum Order Quantity: 1; Reeling: True; ComponentLink1URL: http://www.mouser.com/datasheet/2/281/murata_03052018_GRM_Series_1-1310166.pdf; ComponentLink1Description: http://www.mouser.com/datasheet/2/281/murata_03052018_GRM_Series_1-1310166.pdf; Supplier 2: Farnell; Supplier Part Number 2: 2456107
C107-C109 = TCC0402X7R105K6R3AT: as C103 on sheet CB_CONNECTOR; Supplier 1: LCSC; Supplier Part Number 1: C5448871; Manufacturer: CCTC; Manufacturer Part Number: TCC0402X7R105K6R3AT; Category: Ceramic Capacitors; Stock 1: 242350; Pricing 1: 50=0.0089, 500=0.0072, 1500=0.0063, 10000=0.0058, 20000=0.0053, 50000=0.005 (USD); ComponentLink1URL: https://datasheet.octopart.com:443/TCC0402X7R105K6R3AT-CCTC-datasheet-194166649.pdf?src-supplier=LCSC; ComponentLink1Description: https://datasheet.octopart.com:443/TCC0402X7R105K6R3AT-CCTC-datasheet-194166649.pdf?src-supplier=LCSC; ComponentLink2URL: https://datasheet.octopart.com:443/TCC0402X7R105K6R3AT-CCTC-datasheet-192317456.pdf?src-supplier=HQonline; ComponentLink2Description: https://datasheet.octopart.com:443/TCC0402X7R105K6R3AT-CCTC-datasheet-192317456.pdf?src-supplier=HQonline
D16 = BAT6404E6327HTSA1: Infineon 40V 250mA, Rectifier & Schottky Diode, SOT-23 BAT6404E6327HTSA1; Forward Voltage: 750mV; Peak Non-Repetitive Surge Current: 800mA; Reverse Recovery Time: 5ns; Average Rectified Current: 120mA; Value: 4pF; Element Configuration: Dual; Max Reverse Current: 2uA; Supplier 1: Mouser; Supplier Part Number 1: 726-BAT6404E6327HTSA; Manufacturer: Infineon; Manufacturer Part Number: BAT6404E6327HTSA1; RoHS: Yes; Category: Rectifier Diodes; Stock 1: 384914; Pricing 1: 1=0.15, 10=0.099, 50=0.099, 100=0.06, 1000=0.052, 10000=0.038 (USD); Mounting Technology: Surface Mount; Case/Package: SOT-23; Pins: 3; Min Operating Temperature: -55°C; Max Operating Temperature: 150°C; Packaging: Tape and Reel; Current Rating: 250mA; Voltage Rating (DC): 40V; Series: -; Max Reverse Voltage (DC): 40V; Max Forward Surge Current (Ifsm): 800mA; Package Quantity: 3000NUMBER; Reverse Voltage: 40V; Length: 2.9mm; Width: 1.3mm; Height: 1.1mm; Radiation Hardening: No; Lead Free: Lead Free; Halogen Free: Not Halogen Free; RoHS Compliant: Yes; Reach SVHC Compliant: 4186SVHC; ComponentLink1URL: https://datasheet.ciiva.com/3049/infineon-bat64series-ds-v01-01-en-3049368.pdf?src-supplier=Avnet; ComponentLink1Description: https://datasheet.ciiva.com/3049/infineon-bat64series-ds-v01-01-en-3049368.pdf?src-supplier=Avnet; ComponentLink2URL: https://datasheet.ciiva.com/6390/infineon-bat64series-ds-v01-01-en-6390184.pdf?src-supplier=Digikey; ComponentLink2Description: https://datasheet.ciiva.com/6390/infineon-bat64series-ds-v01-01-en-6390184.pdf?src-supplier=Digikey; ComponentLink3URL: https://datasheet.ciiva.com/6390/infineon-bat64series-ds-v01-01-en-6390183.pdf?src-supplier=Digikey; ComponentLink3Description: https://datasheet.ciiva.com/6390/infineon-bat64series-ds-v01-01-en-6390183.pdf?src-supplier=Digikey; ComponentLink4URL: https://datasheet.ciiva.com/8302/infineon-bat64series-ds-v01-01-en-8302938.pdf?src-supplier=Avnet; ComponentLink4Description: https://datasheet.ciiva.com/8302/infineon-bat64series-ds-v01-01-en-8302938.pdf?src-supplier=Avnet; Supplier 2: Farnell; Supplier Part Number 2: 2432680; Supplier 3: LCSC; Supplier Part Number 3: C513276; Supplier 4: TME; Supplier Part Number 4: BAT6404E6327HTSA1
FR6 = 742792023: as FR3-FR5 on sheet Power_3V3; Manufacturer: WURTH ELEKTRONIK; RoHS: YES; Stock 1: 4283; Pricing 1: 1=0,123, 50=0,112, 100=0,103, 500=0,0937, 1000=0,0877, 2000=0,0846 (GBP); Product Range: -; Automotive Qualification Standard: -; Packaging: Cut Tape; ComponentLink1URL: http://www.farnell.com/datasheets/1695980.pdf; ComponentLink1Description: http://www.farnell.com/datasheets/1695980.pdf; ComponentLink2URL: http://www.farnell.com/cad/1670054.zip; ComponentLink2Description: http://www.farnell.com/cad/1670054.zip; Supplier 1: Mouser; Supplier Part Number 1: 710-742792023; Supplier 2: Farnell; Supplier Part Number 2: 1635732; Supplier 3: Digi-Key; Supplier Part Number 3: 732-1613-1-ND; Manufacturer Part Number: 742792023
J17 = 135-3711-201: MMCX -   50 Ohm Connectors; Manufacturer: JOHNSON - CINCH CONNECTIVITY; Supplier 1: Mouser; Supplier Part Number 1: 530-135-3711-201; Manufacturer Part Number: 135-3711-201; RoHS: No; Stock 1: 1530; Pricing 1: 1=4.04000, 10=3.40000, 50=3.40000, 100=3.23000, 1000=2.95000, 10000=2.18000 (USD); ComponentLink1URL: http://www.farnell.com/datasheets/2341587.pdf?src-supplier=Farnell; ComponentLink1Description: http://www.farnell.com/datasheets/2341587.pdf?src-supplier=Farnell; ComponentLink2URL: http://www.farnell.com/datasheets/2341587.pdf?src-supplier=Newark; ComponentLink2Description: http://www.farnell.com/datasheets/2341587.pdf?src-supplier=Newark; Supplier 2: Farnell; Supplier Part Number 2: 1417969; Supplier 3: Arrow Electronics; Supplier Part Number 3: 135-3711-201
R130-R132 R134-R136 = TC0225B300JTCC: as R88-R96 on sheet MCU; Supplier 1: LCSC; Supplier Part Number 1: C50670254; Manufacturer Part Number: TC0225B300JTCC; Category: Uncategorized; Stock 1: 4950; Pricing 1: 50=0.0203, 500=0.0161, 1500=0.0137, 10000=0.0123, 20000=0.0111, 50000=0.0104 (USD); ComponentLink1URL: https://datasheet.octopart.com:443/TC0225B300JTCC-Uniroyal-datasheet-194228366.pdf?src-supplier=LCSC; ComponentLink1Description: https://datasheet.octopart.com:443/TC0225B300JTCC-Uniroyal-datasheet-194228366.pdf?src-supplier=LCSC; Resistance: 30R
R133 = RT0603BRE0750RL: 100mW Thin Film Resistor ±50ppm/℃ ±0.1% 50Ω 0603 Chip Resistor - Surface Mount ROHS; Manufacturer: Yageo Group; Temperature Coefficient: 50ppm/°C; Working Voltage: 75V; Manufacturer Part Number: RT0603BRE0750RL; RoHS: Compliant; Category: Chip SMD Resistors; Stock 1: 3090; Pricing 1: 1=0.109, 25=0.092, 50=0.086, 100=0.08, 250=0.075, 500=0.071, 1000=0.068 (USD); Case/Package: 0603; China RoHS: Non-Compliant; Composition: Thin Film; Country of Origin: Mainland China, Taiwan; Export Control Classification Number (ECCN) Code: EAR99; Features: Moisture Resistant; Height: 558.8µm; Harmonized Tariff Schedule (HTS) Code: 8533.21.00.30; Introduction Date: 2017-09-12; Length: 1.6002mm; Lifecycle Status: Production; Max Operating Temperature: 155°C; Max Power Dissipation: 100mW; Min Operating Temperature: -55°C; Mounting Technology: Surface Mount; Number of Terminals: 2; Number of Terminations: 2; Packaging: Tape & Reel; Power Rating: 100mW; REACH SVHC: Yes; Resistance: 50R; Tolerance: 0.1%; Width: 787.4µm; ComponentLink1URL: https://datasheet.octopart.com:443/RT0603BRE0750RL-Yageo-datasheet-96443642.pdf?src-supplier=IHS; ComponentLink1Description: https://datasheet.octopart.com:443/RT0603BRE0750RL-Yageo-datasheet-96443642.pdf?src-supplier=IHS; ComponentLink2URL: https://datasheet.octopart.com:443/RT0603BRE0750RL-Yageo-datasheet-176402239.pdf?src-supplier=Future+Electronics; ComponentLink2Description: https://datasheet.octopart.com:443/RT0603BRE0750RL-Yageo-datasheet-176402239.pdf?src-supplier=Future+Electronics; ComponentLink3URL: https://datasheet.octopart.com:443/RT0603BRE0750RL-Yageo-datasheet-169971040.pdf?src-supplier=Future+Electronics; ComponentLink3Description: https://datasheet.octopart.com:443/RT0603BRE0750RL-Yageo-datasheet-169971040.pdf?src-supplier=Future+Electronics; ComponentLink4URL: https://datasheet.octopart.com:443/RT0603BRE0750RL-Yageo-datasheet-166250672.pdf?src-supplier=Future+Electronics; ComponentLink4Description: https://datasheet.octopart.com:443/RT0603BRE0750RL-Yageo-datasheet-166250672.pdf?src-supplier=Future+Electronics; ComponentLink5URL: https://datasheet.octopart.com:443/RT0603BRE0750RL-Yageo-datasheet-137700930.pdf?src-supplier=Future+Electronics; ComponentLink5Description: https://datasheet.octopart.com:443/RT0603BRE0750RL-Yageo-datasheet-137700930.pdf?src-supplier=Future+Electronics; ComponentLink6URL: https://datasheet.octopart.com:443/RT0603BRE0750RL-Yageo-Group-datasheet-141265893.pdf?src-supplier=ODG+(Origin+Data+Global); ComponentLink6Description: https://datasheet.octopart.com:443/RT0603BRE0750RL-Yageo-Group-datasheet-141265893.pdf?src-supplier=ODG+(Origin+Data+Global); ComponentLink7URL: https://datasheet.octopart.com/RT0603BRE0750RL-Yageo-datasheet-86813807.pdf; ComponentLink7Description: https://datasheet.octopart.com/RT0603BRE0750RL-Yageo-datasheet-86813807.pdf; ComponentLink8URL: http://sigma.octopart.com:80/conflict_mineral_statement/Yageo-company-3.pdf?src-supplier=Compliance+Statements; ComponentLink8Description: http://sigma.octopart.com:80/conflict_mineral_statement/Yageo-company-3.pdf?src-supplier=Compliance+Statements; ComponentLink9URL: http://sigma.octopart.com:80/rohs_statement/Yageo-company-2.pdf?src-supplier=Compliance+Statements; ComponentLink9Description: http://sigma.octopart.com:80/rohs_statement/Yageo-company-2.pdf?src-supplier=Compliance+Statements; Supplier 1: Mouser; Supplier Part Number 1: 603-RT0603BRE0750RL; Supplier 2: LCSC; Supplier Part Number 2: C849792; Supplier 3: Farnell; Supplier Part Number 3: RT0603BRE0750RL; Supplier 4: Newark; Supplier Part Number 4: RT0603BRE0750RL
R137 R138 = HQ02WAF0000TCE: Resistor: thick film / jumper; SMD; 0402; 0Ω; 100mW; max 50V; -55÷155°C; UNI-ROYAL; Manufacturer: Uniroyal; Supplier 1: LCSC; Supplier Part Number 1: C2791314; Manufacturer Part Number: HQ02WAF0000TCE; Category: Uncategorized; Stock 1: 5900; Pricing 1: 100=0.0059, 1000=0.0051, 3000=0.0047, 10000=0.0045, 50000=0.0043 (USD); ComponentLink1URL: https://datasheet.octopart.com:443/HQ02WAF0000TCE-Uniroyal-datasheet-194224146.pdf?src-supplier=LCSC; ComponentLink1Description: https://datasheet.octopart.com:443/HQ02WAF0000TCE-Uniroyal-datasheet-194224146.pdf?src-supplier=LCSC; Resistance: 0R
TCXO1 = ATX-H13-F-32.000MHZ-F25-T: Oscillator TCXO 32MHz ±2ppm (Tol) ±2.5ppm (Stability) 15pF CMOS 55% 1.8V/2.5V/2.8V/3V/3.3V T/R; Manufacturer: Abracon; Operating Supply Voltage: 1.8V; Supplier: Mouser; Supplier Part Number: 815-H13F32000MHZF25T; Manufacturer Part Number: ATX-H13-F-32.000MHZ-F25-T; RoHS: Compliant; Category: Controlled Oscillators; Stock: 2722; Pricing: 1=2,16, 10=1,87, 50=1,71, 100=1,62, 1000=1,36, 10000=1,28 (USD); Frequency: 32MHz; Frequency Stability: 2ppm; Introduction Date: 2023-05-26; Lifecycle Status: Production; Pins: 4; Output Type: CMOS; REACH SVHC: Yes; ComponentLink1URL: https://datasheet.octopart.com:443/ATX-H13-F-32.000MHZ-F25-T-Abracon-datasheet-182217459.pdf?src-supplier=IHS; ComponentLink1Description: https://datasheet.octopart.com:443/ATX-H13-F-32.000MHZ-F25-T-Abracon-datasheet-182217459.pdf?src-supplier=IHS; ComponentLink2URL: http://sigma.octopart.com:80/conflict_mineral_statement/Abracon-company-27.pdf?src-supplier=Compliance+Statements; ComponentLink2Description: http://sigma.octopart.com:80/conflict_mineral_statement/Abracon-company-27.pdf?src-supplier=Compliance+Statements; Supplier 1: Mouser; Supplier Part Number 1: 815-H13F32000MHZF25T; Supplier 2: Farnell; Supplier Part Number 2: ATX-H13-F-32.000MHZ-F25-T
U22 = LDK320M33R: as U17 on sheet Power_3V3; Manufacturer Part Number: LDK320M33R; RoHS: RoHS Compliant; Category: Integrated Circuits (ICs); Stock 1: 5592; Pricing 1: 1=0.85, 10=0.748, 100=0.5733, 500=0.4532, 1000=0.36256 (USD); Packaging: Cut Tape (CT); Part Status: Active; Current - Output: 200mA; Operating Temperature: -40°C ~ 125°C (TJ); Mounting Type: Surface Mount; Package / Case: SC-74A, SOT-753; Supplier Device Package: SOT-23-5; ComponentLink1URL: http://www.st.com/content/ccc/resource/technical/document/datasheet/0e/0c/26/c9/a4/d4/4b/a1/DM00236470.pdf/files/DM00236470.pdf/jcr:content/translations/en.DM00236470.pdf; ComponentLink1Description: http://www.st.com/content/ccc/resource/technical/document/datasheet/0e/0c/26/c9/a4/d4/4b/a1/DM00236470.pdf/files/DM00236470.pdf/jcr:content/translations/en.DM00236470.pdf; Supplier 1: Mouser; Supplier Part Number 1: 511-LDK320M33R; Supplier 2: Farnell; Supplier Part Number 2: 3130011; Supplier 3: Digi-Key; Supplier Part Number 3: 497-17034-1-ND
U23 = 74AC04MTCX: IC INVERTER 6CH 6-INP 14TSSOP; Manufacturer: ON Semiconductor; Logic Function: NOT; Number of Inputs: 6; Voltage - Supply: 2 V ~ 6 V; Current - Output High, Low: 24mA, 24mA; Logic Level - Low: 0.9 V ~ 1.65 V; Logic Level - High: 2.1 V ~ 3.85 V; Max Propagation Delay @ V, Max CL: 7ns @ 5V, 50pF; Supplier 1: Digi-Key; Supplier Part Number 1: 74AC04MTCXCT-ND; Manufacturer Part Number: 74AC04MTCX; RoHS: RoHS Compliant; Category: Integrated Circuits (ICs); Stock 1: 2436; Pricing 1: 1=0.42, 10=0.362, 100=0.2705, 500=0.21254, 1000=0.16424 (USD); Packaging: Cut Tape (CT); Part Status: Active; Features: -; Operating Temperature: -40°C ~ 85°C; Mounting Type: Surface Mount; Supplier Device Package: 14-TSSOP; Package / Case: 14-TSSOP (0.173", 4.40mm Width); Base Part Number: 74AC04; ComponentLink1URL: https://www.fairchildsemi.com/datasheets/74/74AC04.pdf; ComponentLink1Description: https://www.fairchildsemi.com/datasheets/74/74AC04.pdf; Supplier 2: Farnell; Supplier Part Number 2: 2724116; Supplier 3: Mouser; Supplier Part Number 3: 512-74AC04MTCX
U24 = TP74AUP1G14C5: Schmitt trigger 800mV~3.6V 3ns@3.3V,5pF 1 500nA SOT-353 Gates and Inverters RoHS; Manufacturer: Tech Public; Supplier: LCSC; Supplier Part Number: C51939619; Manufacturer Part Number: TP74AUP1G14C5; Category: Logic Gates; Stock: 2680; Pricing: 10=0,0496, 100=0,0391, 300=0,0338, 3000=0,0298, 6000=0,0266, 9000=0,025 (USD)